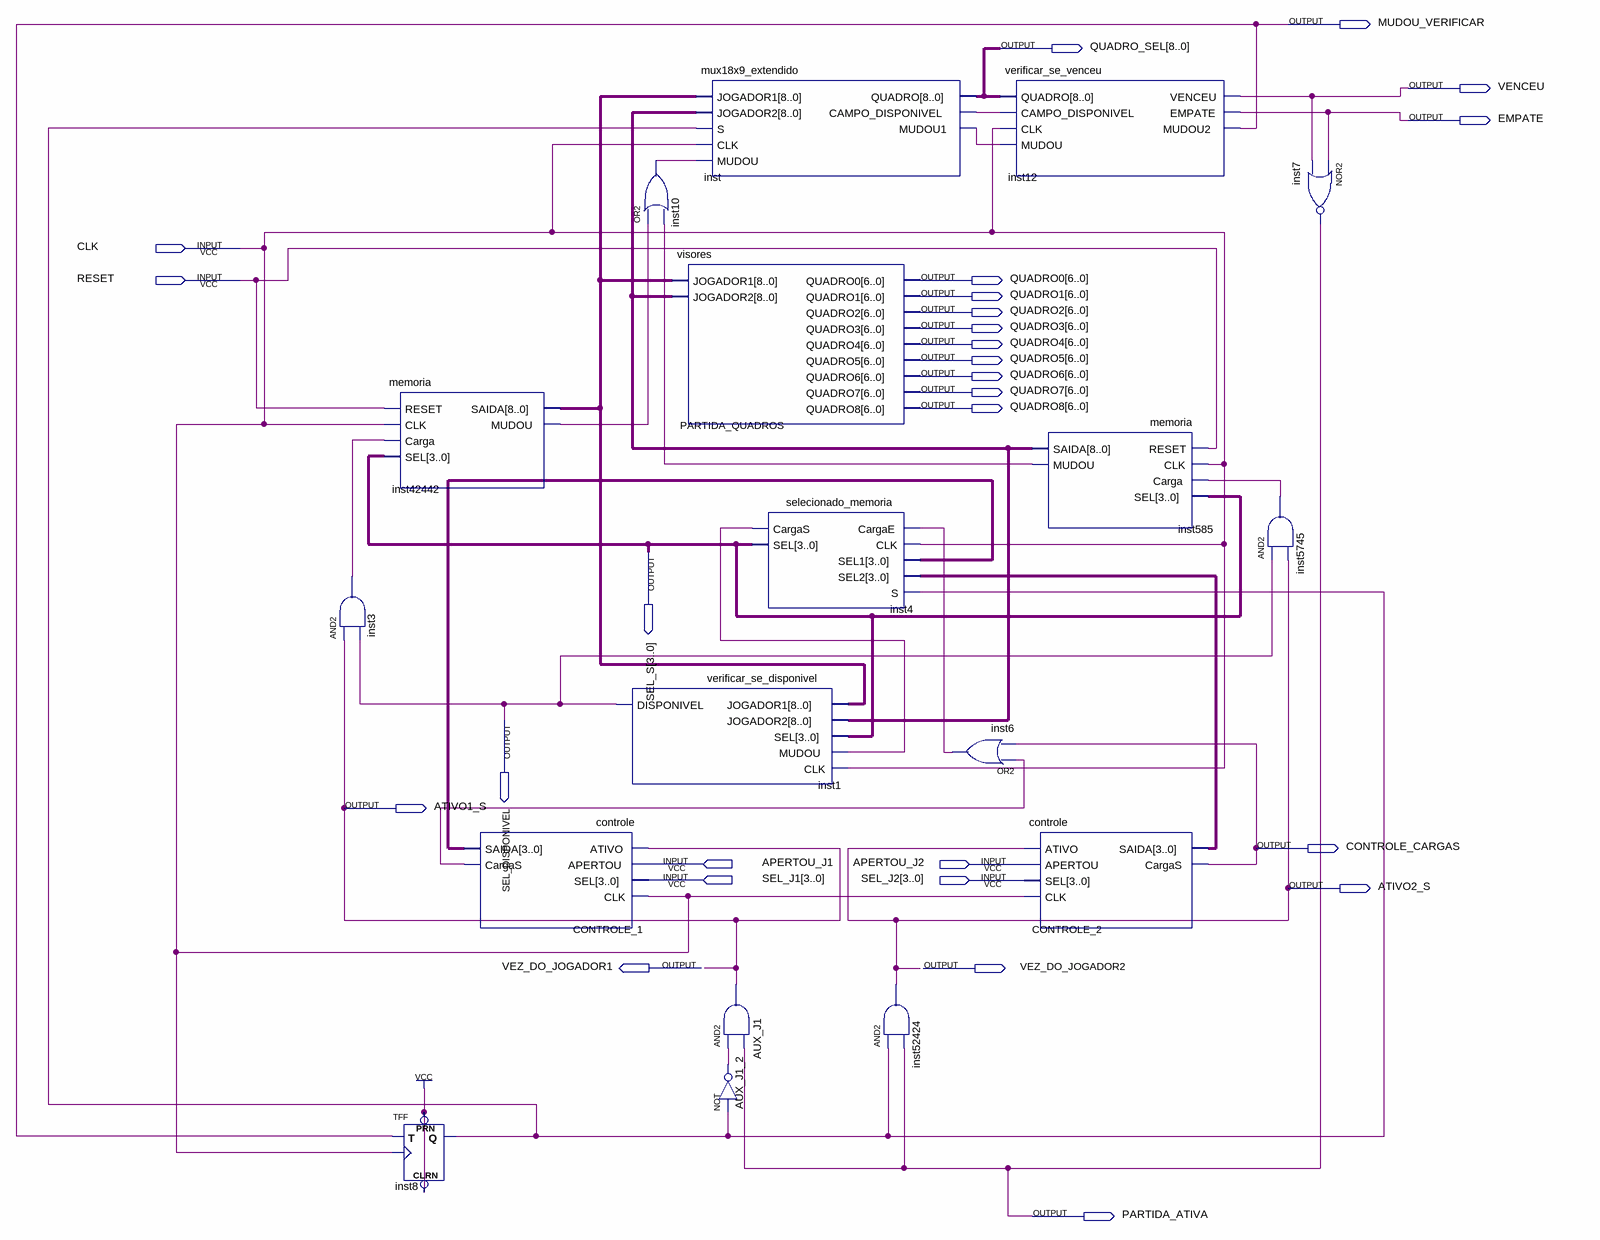
[diagram p0: schematic sheet]
// Quartus schematic hash_game.bdf as structural Verilog: 18 symbols, 27 pins
module hash_game (
  input  CLK,
  input  RESET,
  input  APERTOU_J1,
  input  APERTOU_J2,
  input  [3:0] SEL_J1,
  input  [3:0] SEL_J2,
  output MUDOU_VERIFICAR,
  output [8:0] QUADRO_SEL,
  output VENCEU,
  output EMPATE,
  output [6:0] QUADRO0,
  output [6:0] QUADRO1,
  output [6:0] QUADRO2,
  output [6:0] QUADRO3,
  output [6:0] QUADRO4,
  output [6:0] QUADRO5,
  output [6:0] QUADRO6,
  output [6:0] QUADRO7,
  output [6:0] QUADRO8,
  output [3:0] SEL_S,
  output SEL_DISPONIVEL,
  output ATIVO1_S,
  output CONTROLE_CARGAS,
  output ATIVO2_S,
  output VEZ_DO_JOGADOR1,
  output VEZ_DO_JOGADOR2,
  output PARTIDA_ATIVA
);

  wire AUX_J1_2_out, CONTROLE_1_cargas, inst3_out, inst4_cargas, inst6_out, inst8_q, inst10_out,
       inst585_mudou, inst5745_out, inst42442_mudou, inst_campo_disponivel, inst_mudou1;
  wire [3:0] CONTROLE_1_saida, CONTROLE_2_saida;
  wire [8:0] inst585_saida, inst42442_saida;

  and inst3 (inst3_out, ATIVO1_S, SEL_DISPONIVEL);
  memoria inst42442 (
    .RESET(RESET), .CLK(CLK), .Carga(inst3_out), .SEL(SEL_S), .SAIDA(inst42442_saida), .MUDOU(inst42442_mudou));
  TFF inst8 (.PRN(1'b1), .CLRN(1'b1), .T(MUDOU_VERIFICAR), .CLK(CLK), .Q(inst8_q));
  controle CONTROLE_1 (
    .ATIVO(ATIVO1_S), .APERTOU(APERTOU_J1), .SEL(SEL_J1), .CLK(CLK), .SAIDA(CONTROLE_1_saida),
    .CargaS(CONTROLE_1_cargas));
  verificar_se_disponivel inst1 (
    .JOGADOR1(inst42442_saida), .JOGADOR2(inst585_saida), .SEL(SEL_S), .MUDOU(inst4_cargas), .CLK(CLK),
    .DISPONIVEL(SEL_DISPONIVEL));
  or inst10 (inst10_out, inst42442_mudou, inst585_mudou);
  visores PARTIDA_QUADROS (
    .JOGADOR1(inst42442_saida), .JOGADOR2(inst585_saida), .QUADRO0(QUADRO0), .QUADRO1(QUADRO1),
    .QUADRO2(QUADRO2), .QUADRO3(QUADRO3), .QUADRO4(QUADRO4), .QUADRO5(QUADRO5), .QUADRO6(QUADRO6),
    .QUADRO7(QUADRO7), .QUADRO8(QUADRO8));
  mux18x9_extendido inst (
    .JOGADOR1(inst42442_saida), .JOGADOR2(inst585_saida), .S(inst8_q), .CLK(CLK), .MUDOU(inst10_out),
    .QUADRO(QUADRO_SEL), .CAMPO_DISPONIVEL(inst_campo_disponivel), .MUDOU1(inst_mudou1));
  selecionado_memoria inst4 (
    .CargaE(inst6_out), .CLK(CLK), .SEL1(CONTROLE_1_saida), .SEL2(CONTROLE_2_saida), .S(inst8_q),
    .CargaS(inst4_cargas), .SEL(SEL_S));
  and AUX_J1 (ATIVO1_S, AUX_J1_2_out, PARTIDA_ATIVA);
  not AUX_J1_2 (AUX_J1_2_out, inst8_q);
  and inst52424 (ATIVO2_S, inst8_q, PARTIDA_ATIVA);
  verificar_se_venceu inst12 (
    .QUADRO(QUADRO_SEL), .CAMPO_DISPONIVEL(inst_campo_disponivel), .CLK(CLK), .MUDOU(inst_mudou1),
    .VENCEU(VENCEU), .EMPATE(EMPATE), .MUDOU2(MUDOU_VERIFICAR));
  or inst6 (inst6_out, CONTROLE_1_cargas, CONTROLE_CARGAS);
  memoria inst585 (
    .RESET(RESET), .CLK(CLK), .Carga(inst5745_out), .SEL(SEL_S), .SAIDA(inst585_saida), .MUDOU(inst585_mudou));
  controle CONTROLE_2 (
    .ATIVO(ATIVO2_S), .APERTOU(APERTOU_J2), .SEL(SEL_J2), .CLK(CLK), .SAIDA(CONTROLE_2_saida),
    .CargaS(CONTROLE_CARGAS));
  and inst5745 (inst5745_out, SEL_DISPONIVEL, ATIVO2_S);
  nor inst7 (PARTIDA_ATIVA, EMPATE, VENCEU);

  assign VEZ_DO_JOGADOR1 = ATIVO1_S;
  assign VEZ_DO_JOGADOR2 = ATIVO2_S;
endmodule
